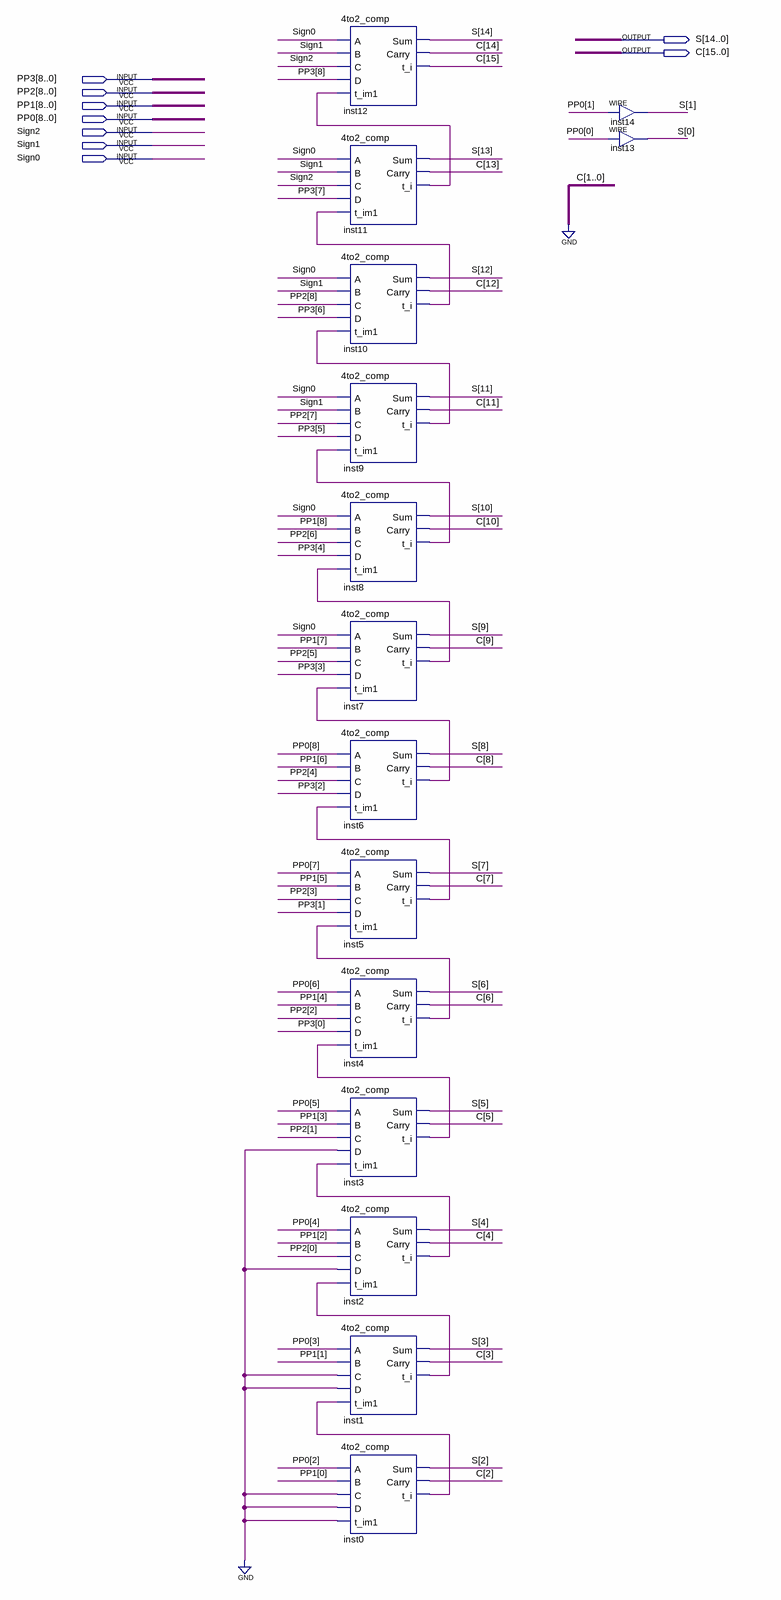
[diagram p0: schematic sheet]
// Quartus schematic 4to2_comp_wordslice.bdf as structural Verilog: 15 symbols, 9 pins
module \4to2_comp_wordslice  (
  input  [8:0] PP3,
  input  [8:0] PP2,
  input  [8:0] PP1,
  input  [8:0] PP0,
  input  Sign2,
  input  Sign1,
  input  Sign0,
  output [14:0] S,
  output [15:0] C
);

  wire inst0_t_i, inst1_t_i, inst2_t_i, inst3_t_i, inst4_t_i, inst5_t_i, inst6_t_i, inst7_t_i, inst8_t_i,
       inst9_t_i, inst10_t_i, inst11_t_i;

  \4to2_comp  inst12 (
    .A(Sign0), .B(Sign1), .C(Sign2), .D(PP3[8]), .t_im1(inst11_t_i), .Sum(S[14]), .Carry(C[14]), .t_i(C[15]));
  \4to2_comp  inst11 (
    .A(Sign0), .B(Sign1), .C(Sign2), .D(PP3[7]), .t_im1(inst10_t_i), .Sum(S[13]), .Carry(C[13]),
    .t_i(inst11_t_i));
  \4to2_comp  inst10 (
    .A(Sign0), .B(Sign1), .C(PP2[8]), .D(PP3[6]), .t_im1(inst9_t_i), .Sum(S[12]), .Carry(C[12]),
    .t_i(inst10_t_i));
  \4to2_comp  inst9 (
    .A(Sign0), .B(Sign1), .C(PP2[7]), .D(PP3[5]), .t_im1(inst8_t_i), .Sum(S[11]), .Carry(C[11]),
    .t_i(inst9_t_i));
  \4to2_comp  inst8 (
    .A(Sign0), .B(PP1[8]), .C(PP2[6]), .D(PP3[4]), .t_im1(inst7_t_i), .Sum(S[10]), .Carry(C[10]),
    .t_i(inst8_t_i));
  \4to2_comp  inst7 (
    .A(Sign0), .B(PP1[7]), .C(PP2[5]), .D(PP3[3]), .t_im1(inst6_t_i), .Sum(S[9]), .Carry(C[9]),
    .t_i(inst7_t_i));
  \4to2_comp  inst6 (
    .A(PP0[8]), .B(PP1[6]), .C(PP2[4]), .D(PP3[2]), .t_im1(inst5_t_i), .Sum(S[8]), .Carry(C[8]),
    .t_i(inst6_t_i));
  \4to2_comp  inst5 (
    .A(PP0[7]), .B(PP1[5]), .C(PP2[3]), .D(PP3[1]), .t_im1(inst4_t_i), .Sum(S[7]), .Carry(C[7]),
    .t_i(inst5_t_i));
  \4to2_comp  inst4 (
    .A(PP0[6]), .B(PP1[4]), .C(PP2[2]), .D(PP3[0]), .t_im1(inst3_t_i), .Sum(S[6]), .Carry(C[6]),
    .t_i(inst4_t_i));
  \4to2_comp  inst3 (
    .A(PP0[5]), .B(PP1[3]), .C(PP2[1]), .D(1'b0), .t_im1(inst2_t_i), .Sum(S[5]), .Carry(C[5]), .t_i(inst3_t_i));
  \4to2_comp  inst2 (
    .A(PP0[4]), .B(PP1[2]), .C(PP2[0]), .D(1'b0), .t_im1(inst1_t_i), .Sum(S[4]), .Carry(C[4]), .t_i(inst2_t_i));
  \4to2_comp  inst1 (
    .A(PP0[3]), .B(PP1[1]), .C(1'b0), .D(1'b0), .t_im1(inst0_t_i), .Sum(S[3]), .Carry(C[3]), .t_i(inst1_t_i));
  \4to2_comp  inst0 (
    .A(PP0[2]), .B(PP1[0]), .C(1'b0), .D(1'b0), .t_im1(1'b0), .Sum(S[2]), .Carry(C[2]), .t_i(inst0_t_i));
  assign S[1] = PP0[1];  // WIRE inst14
  assign S[0] = PP0[0];  // WIRE inst13

  assign C[1:0] = 2'b00;
endmodule
